# Altium project DSO.PrjPCB
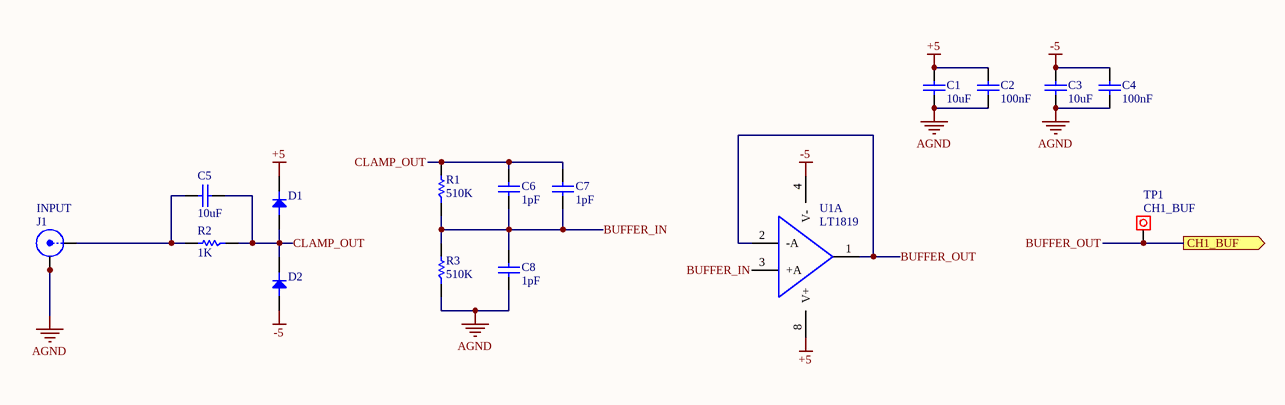
[diagram p0: DSO_Front.SchDoc]
11 sheets, 154 parts. Net scope: hierarchical (ports join the sheet entries above them; power ports are global).
Board file: DSO.PcbDoc
Sheets:
  DSO_Front.SchDoc
  DSO_Top.SchDoc
  DSO_ADC.SchDoc
  DSO_Trig.SchDoc
  DSO_Counters.SchDoc
    U_DSO_CPLD = DSO_CPLD.SchDoc
  DSO_RAM.SchDoc
  DSO_Clock.SchDoc
  DSO_Control.SchDoc
  DSO_IO.SchDoc
  DSO_Power.SchDoc

## Sheet DSO_Front.SchDoc: Schematic_Name
size A4; CompanyName: University of Melbourne; Engineer: Your Name Here; DocumentNumber: 1; Revision: 0.1; SheetNumber: 1; SheetTotal: 1; Title_Project: Project_Title; StudentNo: Student No.

### Parts
C1  10uF  [0805C]
C2  100nF  [0805C]
C3  10uF  [0805C]
C4  100nF  [0805C]
C5  10uF  [0805C]
C6  1pF  [0805C]
C7  1pF  [0805C]
C8  1pF  [0805C]
D1  Diode  [SOD-123]  (value not drawn)
D2  Diode  [SOD-123]  (value not drawn)
J1  INPUT  [BNC_VERT]
R1  510K  [0805]
R2  1K  [0805]
R3  510K  [0805]
TP1  CH1_BUF  [Testpoin]  (no BOM)
U1  LT1819  [SOIC-8]  (part A of 2)

### Ports
CH1_BUF (out)

### Nets
+5: C1.1 C2.1 D1.K U1.8(V+)
-5: C3.1 C4.1 D2.A U1.4(V-)
AGND: C1.2 C2.2 C3.2 C4.2 C8.2 J1.2(Y) J1.3(Y) J1.4(Y) J1.5(Y) R3.1
BUFFER_IN: C6.2 C7.2 C8.1 R1.1 R3.2 U1.3(+A)
BUFFER_OUT: TP1.1 U1.1(OUTA) U1.2(-A) ; port CH1_BUF
CLAMP_OUT: C5.1 C6.1 C7.1 D1.A D2.K R1.2 R2.1
NetC5_2: C5.2 J1.1(X) R2.2

### Library data of the parts
C1-C8 = C: Capacitor; Reviewed by: RM - 2018/08/05; Revision: July-2002: Re-released for DXP Platform.; Supplier 1: *; Supplier Part Number 1: *
  C1 C3 C5: Value: 10uF
  C2 C4: Value: 100nF
  C6-C8: Value: 1pF
D1 D2 = D: Reviewed by: RM - 2018/08/05; Revision: July-2002: Re-released for DXP Platform.; Supplier 1: *; Supplier Part Number 1: *
J1 = BNC: BNC Straight; Reviewed by: RM - 2018/08/05; Supplier Part Number 1: A97581-ND; Supplier 1: Digi-Key
R1-R3 = R: Resistor; Reviewed by: RM - 2018/08/05; Supplier 1: *; Suppler Part Number 1: *
  R1 R3: Value: 510K
  R2: Value: 1K
TP1 = Test Point: Pad; Value: CH1_BUF
U1 = LT1819: OpAmp High Frequency Dual; Reviewed by: RM - 2018/08/05; Supplier 1: Digi-Key; Supplier Part Number 1: LT1819CMS8#PBF-ND

## Sheet DSO_Top.SchDoc: Schematic_Name
size A4; CompanyName: University of Melbourne; Engineer: Your Name Here; DocumentNumber: 1; Revision: 0.1; SheetNumber: 1; SheetTotal: 1; Title_Project: Project_Title; StudentNo: Student No.

## Sheet DSO_ADC.SchDoc: Schematic_Name
size A4; CompanyName: University of Melbourne; Engineer: Your Name Here; DocumentNumber: 1; Revision: 0.1; SheetNumber: 1; SheetTotal: 1; Title_Project: Project_Title; StudentNo: Student No.
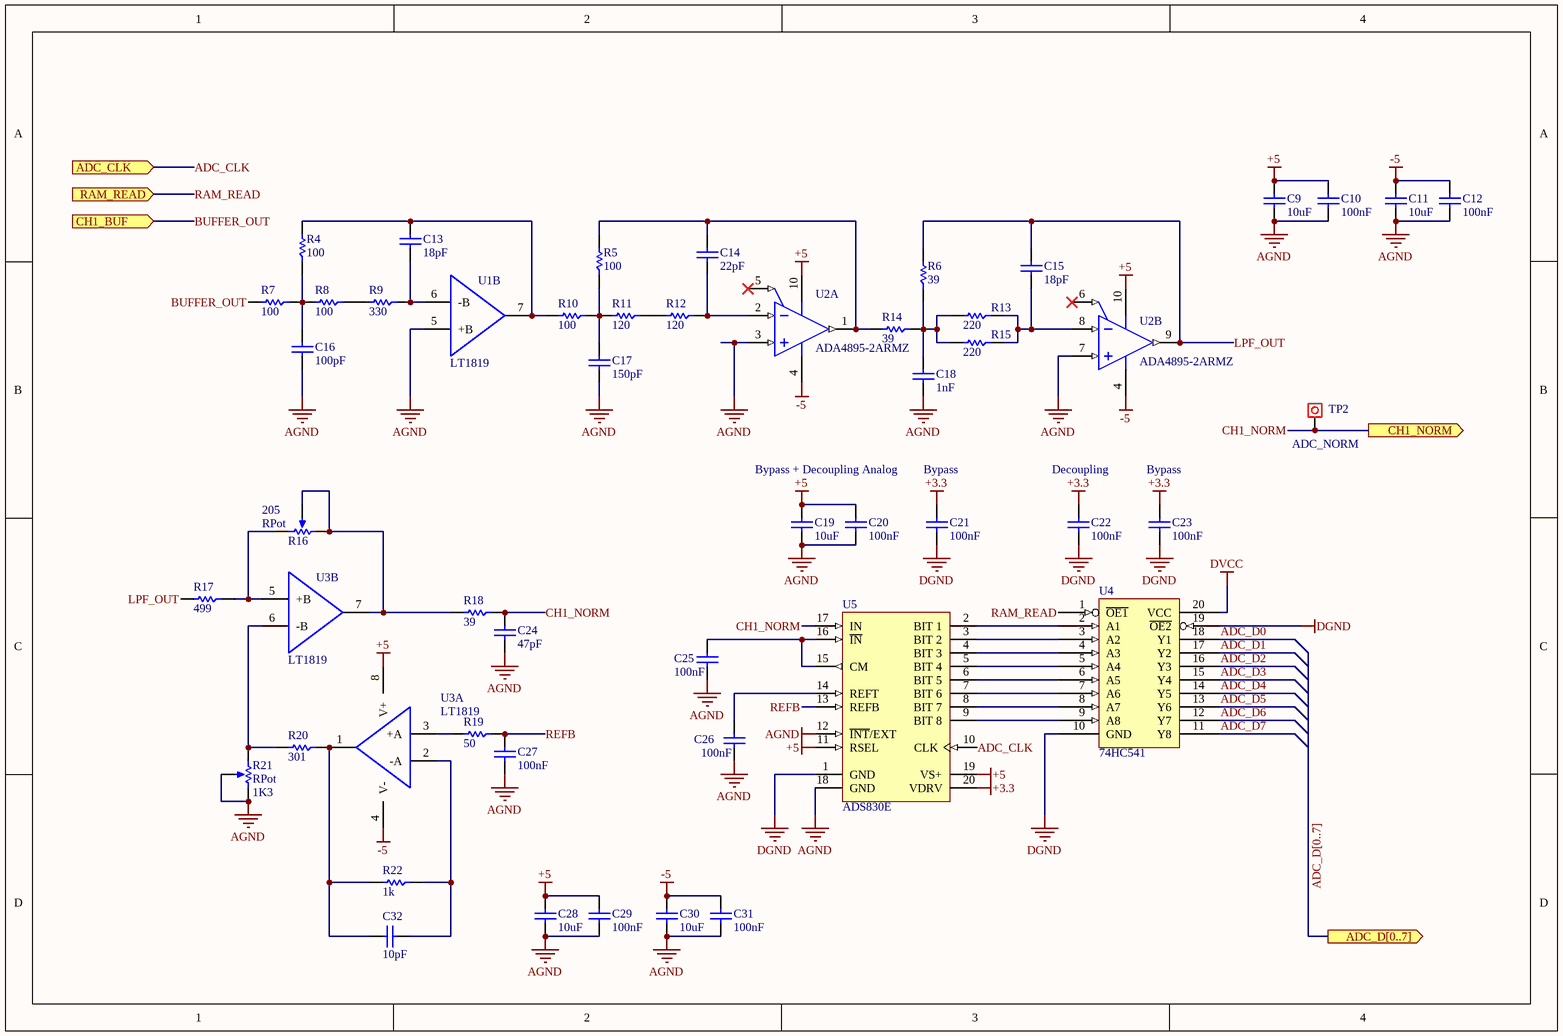
[diagram p1: DSO_ADC.SchDoc]

### Parts
C9  10uF  [0805C]
C10  100nF  [0805C]
C11  10uF  [0805C]
C12  100nF  [0805C]
C13  18pF  [0805C]
C14  22pF  [0805C]
C15  18pF  [0805C]
C16  100pF  [0805C]
C17  150pF  [0805C]
C18  1nF  [0805C]
C19  10uF  [0805C]
C20  100nF  [0805C]
C21  100nF  [0805C]
C22  100nF  [0805C]
C23  100nF  [0805C]
C24  47pF  [0805C]
C25  100nF  [0805C]
C26  100nF  [0805C]
C27  100nF  [0805C]
C28  10uF  [0805C]
C29  100nF  [0805C]
C30  10uF  [0805C]
C31  100nF  [0805C]
C32  10pF  [0805C]
R4  100  [0805]
R5  100  [0805]
R6  39  [0805]
R7  100  [0805]
R8  100  [0805]
R9  330  [0805]
R10  100  [0805]
R11  120  [0805]
R12  120  [0805]
R13  220  [0805]
R14  39  [0805]
R15  220  [0805]
R16  RPot  value 205  [VR5]
R17  499  [0805]
R18  39  [0805]
R19  50  [0805]
R20  301  [0805]
R21  RPot  value 1K3  [VR5]
R22  1k  [0805]
TP2  ADC_NORM  [Testpoin]  (no BOM)
U1  LT1819  [SOIC-8]  (part B of 2)
U2  ADA4895-2ARMZ  [ADI-RM-10_M]  (parts A,B of 2)
U3  LT1819  [SOIC-8]  (parts A,B of 2)
U4  74HC541  [SOT163-1_N]
U5  ADS830E  [TI-DBQ20_L]

### Ports
ADC_CLK (in), ADC_D[0..7] (out), CH1_BUF (in), CH1_NORM (out), RAM_READ (in)

### Nets
+3.3: C21.1 C22.1 C23.1 U4.20(VCC) U5.20(VDRV)  [also labelled DVCC]
+5: C9.1 C10.1 C19.1 C20.1 C28.1 C29.1 U2.10(+VS) U3.8(V+) U5.11(RSEL) U5.19(VS+)
-5: C11.1 C12.1 C30.1 C31.1 U2.4(-VS) U3.4(V-)
AGND: C9.2 C10.2 C11.2 C12.2 C16.2 C17.2 C18.2 C19.2 C20.2 C24.2 C25.2 C26.2 C27.2 C28.2 C29.2 C30.2 C31.2 R21.2(TAP) R21.3(BOT) U1.5(+B) U2.3(+IN_1) U2.7(+IN_2) U5.12(~{INT}/EXT) U5.18(GND)
DGND: C21.2 C22.2 C23.2 U4.10(GND) U4.19(~{OE2}) U5.1(GND)
ADC_CLK: U5.10(CLK) ; port ADC_CLK
ADC_D0: U4.18(Y1)
ADC_D1: U4.17(Y2)
ADC_D2: U4.16(Y3)
ADC_D3: U4.15(Y4)
ADC_D4: U4.14(Y5)
ADC_D5: U4.13(Y6)
ADC_D6: U4.12(Y7)
ADC_D7: U4.11(Y8)
BUFFER_OUT: R7.2 ; port CH1_BUF
CH1_NORM: C24.1 R18.1 TP2.1 U5.17(IN) ; port CH1_NORM
LPF_OUT: C15.1 R6.2 R17.2 U2.9(OUT_2)
RAM_READ: U4.1(~{OE1}) ; port RAM_READ
REFB: C27.1 R19.1 U5.13(REFB)
NetC13_1: C13.1 R4.2 R10.2 U1.7(OUTB)
NetC13_2: C13.2 R9.1 U1.6(-B)
NetC14_1: C14.1 R5.2 R14.2 U2.1(OUT_1)
NetC14_2: C14.2 R12.1 U2.2(-IN_1)
NetC15_2: C15.2 R13.1 R15.1 U2.8(-IN_2)
NetC16_1: C16.1 R4.1 R7.1 R8.2
NetC17_1: C17.1 R5.1 R10.1 R11.2
NetC18_1: C18.1 R6.1 R13.2 R14.1 R15.2
NetC25_1: C25.1 U5.15(CM) U5.16(~{IN})
NetC26_1: C26.1 U5.14(REFT)
NetC32_1: C32.1 R20.1 R22.2 U3.1(OUTA)
NetC32_2: C32.2 R22.1 U3.2(-A)
NetR8_1: R8.1 R9.2
NetR11_1: R11.1 R12.2
NetR16_1: R16.1(TOP) R16.2(TAP) R18.2 U3.7(OUTB)
NetR16_3: R16.3(BOT) R17.1 U3.5(+B)
NetR19_2: R19.2 U3.3(+A)
NetR20_2: R20.2 R21.1(TOP) U3.6(-B)
NetU4_2: U4.2(A1) U5.2(BIT_1)
NetU4_3: U4.3(A2) U5.3(BIT_2)
NetU4_4: U4.4(A3) U5.4(BIT_3)
NetU4_5: U4.5(A4) U5.5(BIT_4)
NetU4_6: U4.6(A5) U5.6(BIT_5)
NetU4_7: U4.7(A6) U5.7(BIT_6)
NetU4_8: U4.8(A7) U5.8(BIT_7)
NetU4_9: U4.9(A8) U5.9(BIT_8)

Not connected (* = marked no-connect by the designer): U2 5(~{DISABLE1})* 6(~{DISABLE2})*

### Buses and harness runs
bus ADC_D[0..7] = port ADC_D[0..7]

### Notes on the sheet
- Bypass + Decoupling Analog
- (near C21) Bypass
- Decoupling
- (near C23) Bypass

### Library data of the parts
C9-C32 = C: Capacitor; Reviewed by: RM - 2018/08/05; Revision: July-2002: Re-released for DXP Platform.; Supplier 1: *; Supplier Part Number 1: *
  C9 C11 C19 C28 C30: Value: 10uF
  C10 C12 C20-C23 C25-C27 C29 C31: Value: 100nF
  C13 C15: Value: 18pF
  C14: Value: 22pF
  C16: Value: 100pF
  C17: Value: 150pF
  C18: Value: 1nF
  C24: Value: 47pF
  C32: Value: 10pF
R4-R15 R17-R20 R22 = R: Resistor; Reviewed by: RM - 2018/08/05; Supplier 1: *; Suppler Part Number 1: *
  R4 R5 R7 R8 R10: Value: 100
  R6 R14 R18: Value: 39
  R9: Value: 330
  R11 R12: Value: 120
  R13 R15: Value: 220
  R17: Value: 499
  R19: Value: 50
  R20: Value: 301
  R22: Value: 1k
R16 R21 = RPot: Potentiometer; Sim Note: Enter the Resistance value and the set point into parameter fields.; Set Position: 0.5; Published: 8-Jun-2000; LatestRevisionDate: 17-Jul-2002; LatestRevisionNote: Re-released for DXP Platform.; PackageReference: VR5; Publisher: Altium Limited; PackageDescription: Variable Resistor, Thru-Hole; 3 Leads
TP2 = Test Point: Pad; Value: ADC_NORM
U1 U3 = LT1819: as U1 on sheet DSO_Front; Supplier 1: Digi-Key; Supplier Part Number 1: LT1819CMS8#PBF-ND
U2 = CMP-0384-01589-1: Double Channel Low Wide Band Noise Operational Amplifier, 236 MHz BW, 943 V/us SR, Industrial, 10-pin SOP (RM-10), Tray; Manufacturer: Analog Devices; Amplifiers Per Package: 2; Small Signal Bandwidth: 236MHz; V Span Min: 3V; Input Offset Voltage: 28uV; Iq/Amp: 3mA; Input Bias Current: 11uA; V Span Max: 10V; ComponentLink1Description: Manufacturer URL; ComponentLink3Description: Package Specification; ComponentLink3URL: http://www.analog.com/static/imported-files/packages/PKG_PDF/MSOP%28RM%29/RM_10.pdf; Code_JEDEC: MO-187-BA; Slew Rate: 943V/us; ComponentLink2Description: Datasheet; Generic Part Number: ADA4895-2; PackageReference: RM-10; ComponentLink2URL: http://www.analog.com/static/imported-files/data_sheets/ADA4895-2.PDF; Mounting Technology: Surface Mount; DatasheetVersion: Rev. 0; PartNumber: ADA4895-2ARMZ; ComponentLink1URL: http://www.analog.com/en/index.html; Packing: Tray; PackageDescription: 10-Pin Mini Small Outline Package, Body 3 x 3 mm, Pitch 0.5 mm
U4 = 74HC541: (ADV) Octal Buffer, Line Driver; Reviewed by: RM - 2018/08/05; Supplier 1: Digi-Key; Supplier Part Number 1: 296-1202-1-ND
U5 = ADS830E: 8-Bit, 60 MSPS ADC Single-Ended / Differential Input, Internal / External Reference and Programmble Input Range, -40 to 85 degC, 20-pin SOP (DBQ20), Green (RoHS & no Sb/Br); Reviewed by: RM - 2018/08/05; ComponentLink2URL: http://www.ti.com/general/docs/lit/getliterature.tsp?genericPartNumber=ADS830&fileType=pdf; ComponentLink2Description: Datasheet; ComponentLink1URL: http://www.ti.com/; ComponentLink3URL: http://www.ti.com/litv/pdf/mpds210a; ComponentLink3Description: Package Specification; ComponentLink1Description: Manufacturer URL; Supplier 1: Digi-Key; Supplier Part Number 1: ADS830E-ND

## Sheet DSO_Trig.SchDoc: Schematic_Name
size A4; CompanyName: University of Melbourne; Engineer: Your Name Here; DocumentNumber: 1; Revision: 0.1; SheetNumber: 1; SheetTotal: 1; Title_Project: Project_Title; StudentNo: Student No.
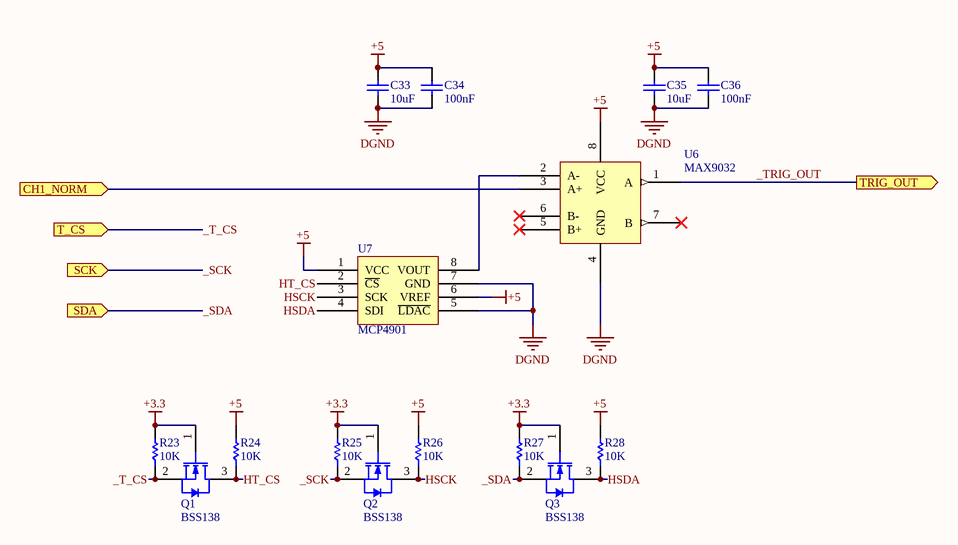
[diagram p2: DSO_Trig.SchDoc]

### Parts
C33  10uF  [0805C]
C34  100nF  [0805C]
C35  10uF  [0805C]
C36  100nF  [0805C]
Q1  BSS138  [SOT23]
Q2  BSS138  [SOT23]
Q3  BSS138  [SOT23]
R23  10K  [0805]
R24  10K  [0805]
R25  10K  [0805]
R26  10K  [0805]
R27  10K  [0805]
R28  10K  [0805]
U6  MAX9032  [SOIC-8]
U7  MCP4901  [SOIC-8]

### Ports
CH1_NORM (in), SCK (in), SDA (in), T_CS (in), TRIG_OUT (out)

### Nets
+3.3: Q1.1(G) Q2.1(G) Q3.1(G) R23.2 R25.2 R27.2
+5: C33.1 C34.1 C35.1 C36.1 R24.2 R26.2 R28.2 U6.8(VCC) U7.1(VCC) U7.6(VREF)
DGND: C33.2 C34.2 C35.2 C36.2 U6.4(GND) U7.5(~{LDAC}) U7.7(GND)
_SCK: Q2.2(S) R25.1 ; port SCK
_SDA: Q3.2(S) R27.1 ; port SDA
_T_CS: Q1.2(S) R23.1 ; port T_CS
_TRIG_OUT: U6.1(A) ; port TRIG_OUT
HSCK: Q2.3(D) R26.1 U7.3(SCK)
HSDA: Q3.3(D) R28.1 U7.4(SDI)
HT_CS: Q1.3(D) R24.1 U7.2(~{CS})
NetU6_2: U6.2(A-) U7.8(VOUT)
NetU6_3: U6.3(A+) ; port CH1_NORM

Not connected (* = marked no-connect by the designer): U6 5(B+)* 6(B-)* 7(B)*

### Library data of the parts
C33-C36 = C: Capacitor; Reviewed by: RM - 2018/08/05; Revision: July-2002: Re-released for DXP Platform.; Supplier 1: *; Supplier Part Number 1: *
  C33 C35: Value: 10uF
  C34 C36: Value: 100nF
Q1-Q3 = MOSFET-N: N-Channel MOSFET; PackageDocument: 1995/1996; Published: 8-Jun-2000; LatestRevisionDate: 17-Jul-2002; LatestRevisionNote: Re-released for DXP Platform.; PackageReference: E3; Publisher: Altium Limited
R23-R28 = R: Resistor; Reviewed by: RM - 2018/08/05; Supplier 1: *; Suppler Part Number 1: *; Value: 10K
U6 = MAX9032: Dual Comparator; Reviewed by: RM - 2018/08/05; Supplier 1: Digi-Key; Supplier Part Number 1: MAX9032ASA-ND
U7 = MCP4901: DAC 8bit SPI; Reviewed by: RM - 2018/08/05; Supplier 1: Digi-Key; Supplier Part Number 1: MCP4901-E/SN-ND

## Sheet DSO_Counters.SchDoc: Schematic_Name
size A4; CompanyName: University of Melbourne; DrawnBy: Student_#; Engineer: Your Name Here; Organization: University of Melbourne; DocumentNumber: 5; Revision: 0.1; SheetNumber: 5; SheetTotal: 10; Title_Project: Project_Title
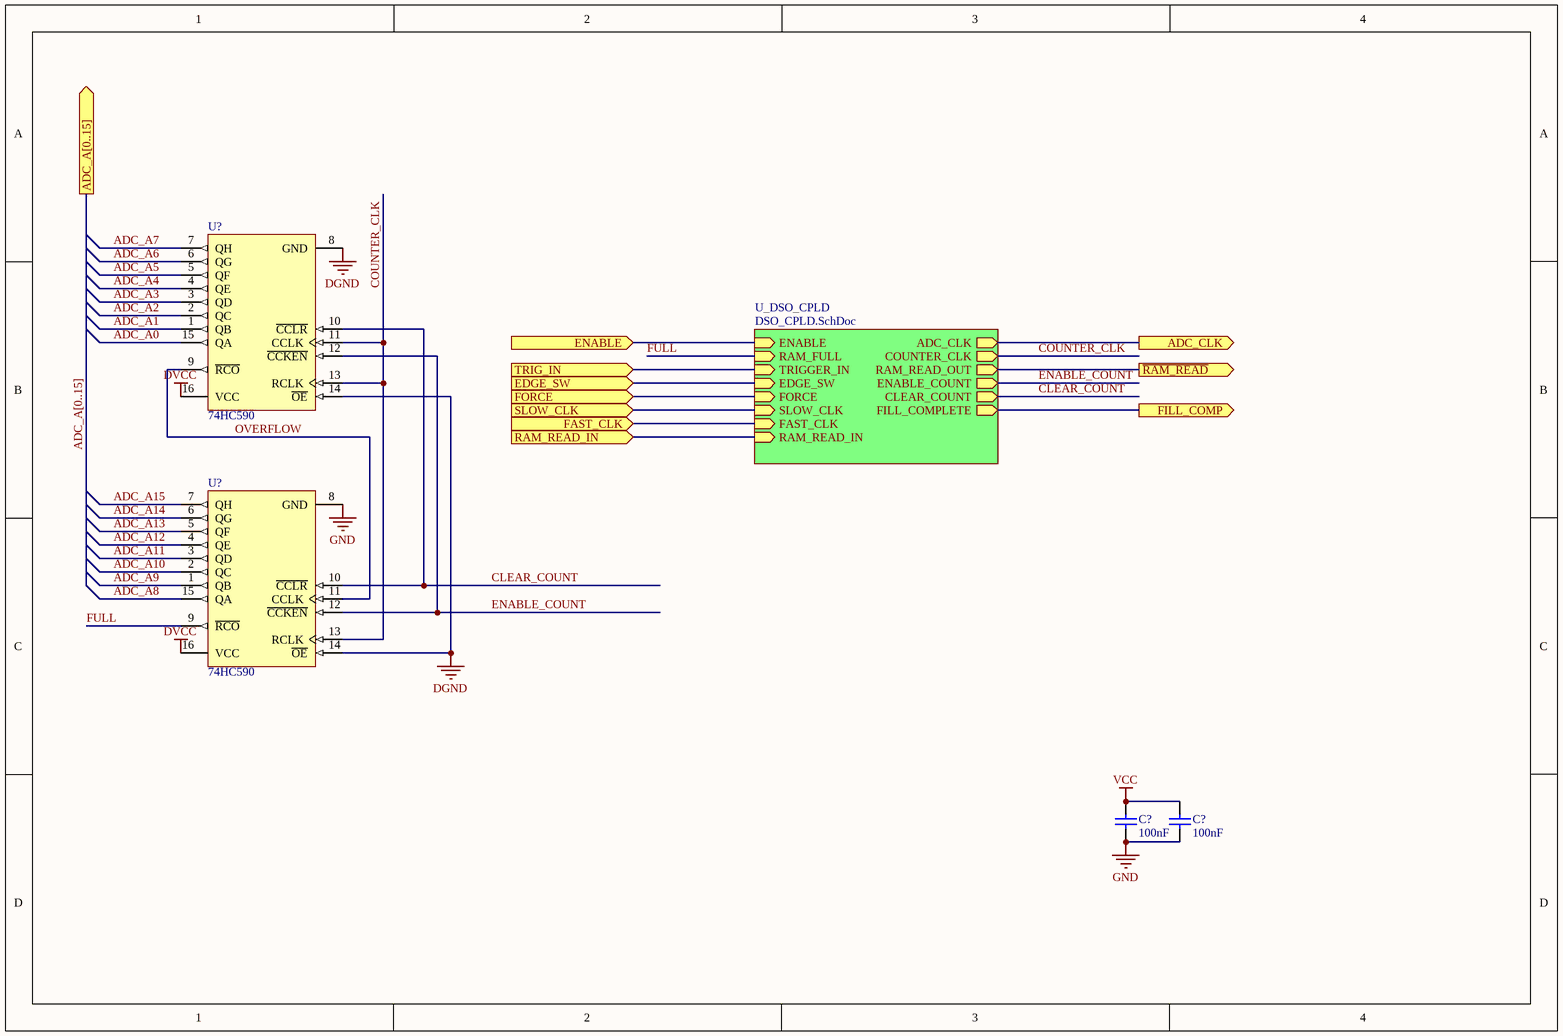
[diagram p3: DSO_Counters.SchDoc]

### Parts
(Parts that share a designator on the sheet are numbered #1, #2 ... from top to bottom, then left to right.)
C?#1  100nF  [0805C]
C?#2  100nF  [0805C]
U?#1  74HC590  [SOIC-16]
U?#2  74HC590  [SOIC-16]

### Sub-sheets
U_DSO_CPLD = DSO_CPLD.SchDoc: ENABLE (in), RAM_FULL (in), TRIGGER_IN (in), EDGE_SW (in), FORCE (in), SLOW_CLK (in), FAST_CLK (in), RAM_READ_IN (in), ADC_CLK (out), COUNTER_CLK (out), RAM_READ_OUT (out), ENABLE_COUNT (out), CLEAR_COUNT (out), FILL_COMPLETE (out)

### Ports
ADC_A[0..15] (out), ADC_CLK (out), EDGE_SW (in), ENABLE (in), FAST_CLK (in), FILL_COMP (out), FORCE (in), RAM_READ_IN (in), SLOW_CLK (in), TRIG_IN (in), ~{RAM_READ} (out)

### Nets
DGND: U?#1.8(GND) U?#1.14(~{OE}) U?#2.14(~{OE})
DVCC: U?#1.16(VCC) U?#2.16(VCC)  [project net +3.3]
GND: C?#1.2 C?#2.2 U?#2.8(GND)
VCC: C?#1.1 C?#2.1
ADC_A0: U?#1.15(QA)
ADC_A1: U?#1.1(QB)
ADC_A2: U?#1.2(QC)
ADC_A3: U?#1.3(QD)
ADC_A4: U?#1.4(QE)
ADC_A5: U?#1.5(QF)
ADC_A6: U?#1.6(QG)
ADC_A7: U?#1.7(QH)
ADC_A8: U?#2.15(QA)
ADC_A9: U?#2.1(QB)
ADC_A10: U?#2.2(QC)
ADC_A11: U?#2.3(QD)
ADC_A12: U?#2.4(QE)
ADC_A13: U?#2.5(QF)
ADC_A14: U?#2.6(QG)
ADC_A15: U?#2.7(QH)
CLEAR_COUNT: U?#1.10(~{CCLR}) U?#2.10(~{CCLR}) ; sheet U_DSO_CPLD/CLEAR_COUNT
COUNTER_CLK: U?#1.11(CCLK) U?#1.13(RCLK) U?#2.13(RCLK) ; sheet U_DSO_CPLD/COUNTER_CLK
ENABLE_COUNT: U?#1.12(~{CCKEN}) U?#2.12(~{CCKEN}) ; sheet U_DSO_CPLD/ENABLE_COUNT
FULL: U?#2.9(~{RCO}) ; sheet U_DSO_CPLD/RAM_FULL
OVERFLOW: U?#1.9(~{RCO}) U?#2.11(CCLK)
NetU17_1: port ENABLE, sheet U_DSO_CPLD/ENABLE
NetU17_2: port FORCE, sheet U_DSO_CPLD/FORCE
NetU17_3: port RAM_READ_IN, sheet U_DSO_CPLD/RAM_READ_IN
NetU17_5: port EDGE_SW, sheet U_DSO_CPLD/EDGE_SW
NetU17_6: port ~{RAM_READ}, sheet U_DSO_CPLD/RAM_READ_OUT
NetU17_12: port TRIG_IN, sheet U_DSO_CPLD/TRIGGER_IN
NetU17_28: port FILL_COMP, sheet U_DSO_CPLD/FILL_COMPLETE
NetU17_41: port ADC_CLK, sheet U_DSO_CPLD/ADC_CLK
NetU17_43: port SLOW_CLK, sheet U_DSO_CPLD/SLOW_CLK
NetU17_44: port FAST_CLK, sheet U_DSO_CPLD/FAST_CLK

### Buses and harness runs
bus ADC_A[0..15] = port ADC_A[0..15]

### Library data of the parts
C?#1 C?#2 = C: Capacitor; Reviewed by: RM - 2018/08/05; Revision: July-2002: Re-released for DXP Platform.; Value: 100nF; Supplier 1: *; Supplier Part Number 1: *
U?#1 U?#2 = 74HC590: 8-Bit Binary Counter Register; Reviewed by: RM - 2018/08/05; ComponentLink1Description: Manufacturer Link; ComponentLink1URL: http://www.st.com/; ComponentLink2Description: Datasheet; ComponentLink2URL: http://www.st.com/stonline/products/literature/ds/1986/m74hc590.pdf; Supplier 1: Digi-Key; Supplier Part Number 1: 296-17132-1-ND

## Sheet DSO_CPLD.SchDoc
size A4
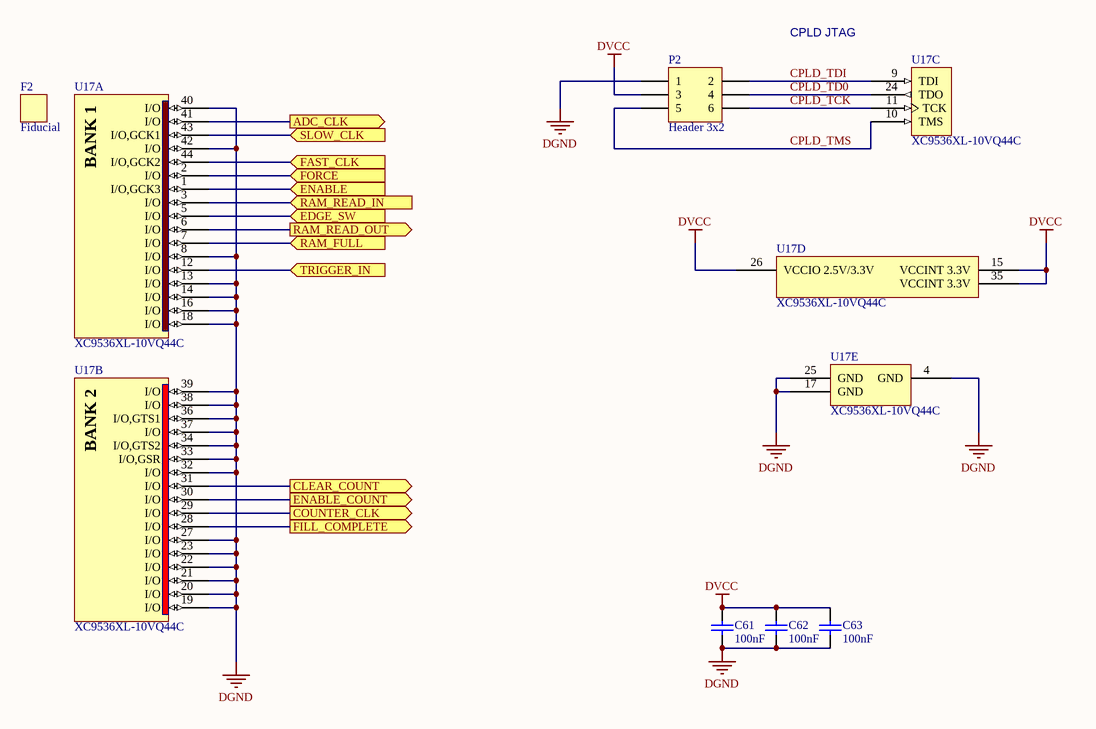
[diagram p4: DSO_CPLD.SchDoc]

### Parts
C61  100nF  [0805C]
C62  100nF  [0805C]
C63  100nF  [0805C]
F2  Fiducial  [FIDUCIAL]  (no BOM)
P2  Header 3x2  [HDR3x2]
U17  XC9536XL-10VQ44C  [VQ44_L]  (parts A,B,C,D,E of 5)

### Ports
ADC_CLK (out), CLEAR_COUNT (out), COUNTER_CLK (out), EDGE_SW (in), ENABLE (in), ENABLE_COUNT (out), FAST_CLK (in), FILL_COMPLETE (out), FORCE (in), RAM_FULL (in), RAM_READ_IN (in), RAM_READ_OUT (out), SLOW_CLK (in), TRIGGER_IN (in)

### Nets
DGND: C61.2 C62.2 C63.2 P2.1 U17.4(GND) U17.8(I/O) U17.13(I/O) U17.14(I/O) U17.16(I/O) U17.17(GND) U17.18(I/O) U17.19(I/O) U17.20(I/O) U17.21(I/O) U17.22(I/O) U17.23(I/O) U17.25(GND) U17.27(I/O) U17.32(I/O) U17.33(I/O,GSR) U17.34(I/O,GTS2) U17.36(I/O,GTS1) U17.37(I/O) U17.38(I/O) U17.39(I/O) U17.40(I/O) U17.42(I/O)
DVCC: C61.1 C62.1 C63.1 P2.3 U17.15(VCCINT_3.3V) U17.26(VCCIO_2.5V/3.3V) U17.35(VCCINT_3.3V)  [project net +3.3]
CLEAR_COUNT: U17.31(I/O) ; port CLEAR_COUNT
COUNTER_CLK: U17.29(I/O) ; port COUNTER_CLK
CPLD_TCK: P2.6 U17.11(TCK)
CPLD_TD0: P2.4 U17.24(TDO)
CPLD_TDI: P2.2 U17.9(TDI)
CPLD_TMS: P2.5 U17.10(TMS)
ENABLE_COUNT: U17.30(I/O) ; port ENABLE_COUNT
FULL: U17.7(I/O) ; port RAM_FULL
NetU17_1: U17.1(I/O,GCK3) ; port ENABLE
NetU17_2: U17.2(I/O) ; port FORCE
NetU17_3: U17.3(I/O) ; port RAM_READ_IN
NetU17_5: U17.5(I/O) ; port EDGE_SW
NetU17_6: U17.6(I/O) ; port RAM_READ_OUT
NetU17_12: U17.12(I/O) ; port TRIGGER_IN
NetU17_28: U17.28(I/O) ; port FILL_COMPLETE
NetU17_41: U17.41(I/O) ; port ADC_CLK
NetU17_43: U17.43(I/O,GCK1) ; port SLOW_CLK
NetU17_44: U17.44(I/O,GCK2) ; port FAST_CLK

### Notes on the sheet
- CPLD JTAG
- (in symbol XC9536XL-10VQG44C, part A) BANK 1
- (in symbol XC9536XL-10VQG44C, part B) BANK 2

### Library data of the parts
C61-C63 = C: Capacitor; Reviewed by: RM - 2018/08/05; Revision: July-2002: Re-released for DXP Platform.; Value: 100nF; Supplier 1: *; Supplier Part Number 1: *
F2 = Fiducial: Fiducial for pick and place machine
P2 = Header 3x2: Header, 5-Pin; Reviewed by: RM - 2018/08/05; Supplier 1: Digi-Key; Supplier Part Number 1: 952-2121-ND
U17 = XC9536XL-10VQG44C: FastFLASH XC900XL, 3.3V High-Performance 36 Macrocell CPLD, 34 User I/Os, 44-Pin VQFP, Speed Grade 10, Commercial Grade; Reviewed by: RM - 2018/08/05; Supplier 1: Digi-Key; Supplier Part Number 1: 122-1385-ND

## Sheet DSO_RAM.SchDoc: Schematic_Name
size A4; CompanyName: University of Melbourne; Engineer: Your Name Here; DocumentNumber: 1; Revision: 0.1; SheetNumber: 1; SheetTotal: 1; Title_Project: Project_Title; StudentNo: Student No.
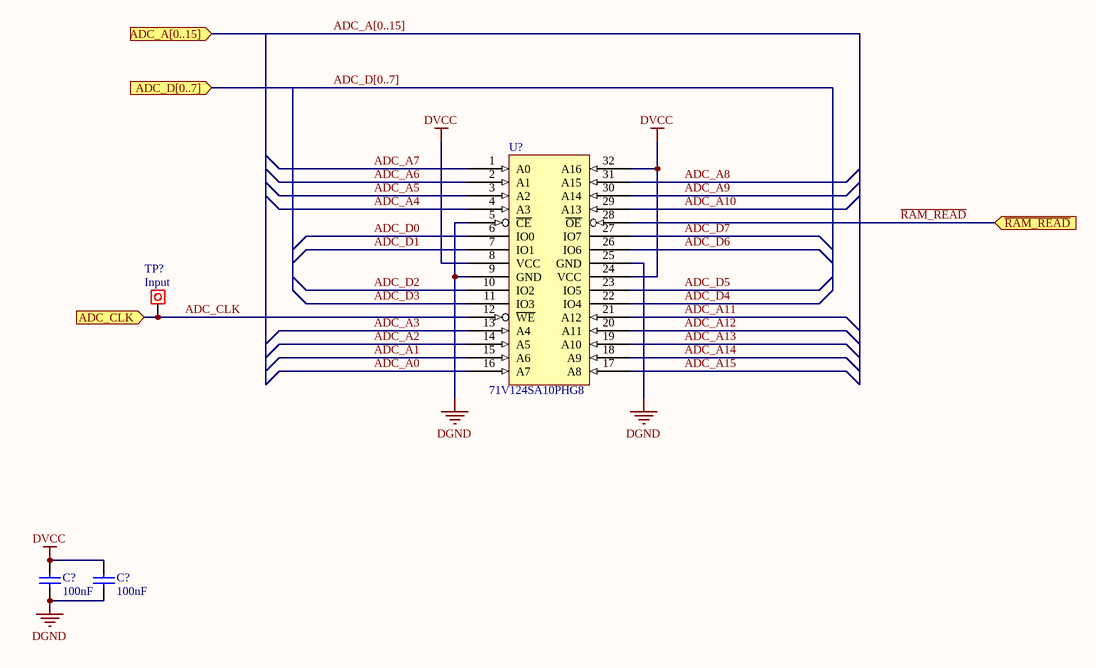
[diagram p5: DSO_RAM.SchDoc]

### Parts
(Parts that share a designator on the sheet are numbered #1, #2 ... from top to bottom, then left to right.)
C?#3  100nF  [0805C]
C?#4  100nF  [0805C]
TP?  INPUT  [Testpoin]
U?#3  71V124SA10PHG8  [TSOP-32]

### Ports
ADC_A[0..15] (in), ADC_CLK (in), ADC_D[0..7] (in), ~{RAM_READ} (in)

### Nets
DGND: C?#3.2 C?#4.2 U?#3.5(~{CE}) U?#3.9(GND) U?#3.25(GND)
DVCC: C?#3.1 C?#4.1 U?#3.8(VCC) U?#3.24(VCC) U?#3.32(A16)  [project net +3.3]
ADC_A0: U?#3.16(A7)
ADC_A1: U?#3.15(A6)
ADC_A2: U?#3.14(A5)
ADC_A3: U?#3.13(A4)
ADC_A4: U?#3.4(A3)
ADC_A5: U?#3.3(A2)
ADC_A6: U?#3.2(A1)
ADC_A7: U?#3.1(A0)
ADC_A8: U?#3.31(A15)
ADC_A9: U?#3.30(A14)
ADC_A10: U?#3.29(A13)
ADC_A11: U?#3.21(A12)
ADC_A12: U?#3.20(A11)
ADC_A13: U?#3.19(A10)
ADC_A14: U?#3.18(A9)
ADC_A15: U?#3.17(A8)
ADC_CLK: TP?.1 U?#3.12(~{WE}) ; port ADC_CLK
ADC_D0: U?#3.6(IO0)
ADC_D1: U?#3.7(IO1)
ADC_D2: U?#3.10(IO2)
ADC_D3: U?#3.11(IO3)
ADC_D4: U?#3.22(IO4)
ADC_D5: U?#3.23(IO5)
ADC_D6: U?#3.26(IO6)
ADC_D7: U?#3.27(IO7)
~{RAM_READ}: U?#3.28(~{OE}) ; port ~{RAM_READ}

### Buses and harness runs
bus ADC_A[0..15] = port ADC_A[0..15]
bus ADC_D[0..7] = port ADC_D[0..7]

### Library data of the parts
C?#3 C?#4 = C: Capacitor; Reviewed by: RM - 2018/08/05; Revision: July-2002: Re-released for DXP Platform.; Value: 100nF; Supplier 1: *; Supplier Part Number 1: *
TP? = Test Point: Pad; Value: Input
U?#3 = CY7C1019D: SRAM 128k x 8; Reviewed by: RM - 2018/08/05; Supplier 1: Digi-Key; Supplier Part Number 1: 428-1967-ND

## Sheet DSO_Clock.SchDoc: Schematic_Name
size A4; CompanyName: University of Melbourne; Engineer: Your Name Here; DocumentNumber: 1; Revision: 0.1; SheetNumber: 1; SheetTotal: 1; Title_Project: Project_Title; StudentNo: Student No.
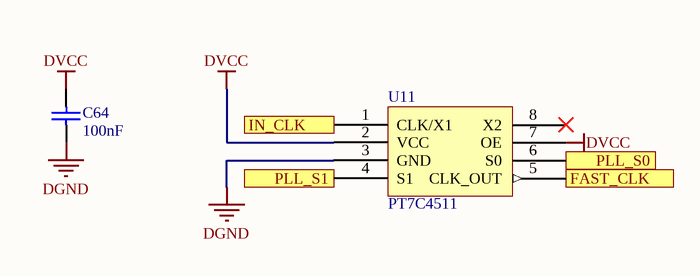
[diagram p6: DSO_Clock.SchDoc]

### Parts
C64  100nF  [0805C]
U11  PT7C4511  [SOIC-8]

### Ports
FAST_CLK (out), IN_CLK (in), PLL_S0 (in), PLL_S1 (in)

### Nets
DGND: C64.2 U11.3(GND)
DVCC: C64.1 U11.2(VCC) U11.7(OE)  [project net +3.3]
NetU11_1: U11.1(CLK/X1) ; port IN_CLK
NetU11_4: U11.4(S1) ; port PLL_S1
NetU11_5: U11.5(CLK_OUT) ; port FAST_CLK
NetU11_6: U11.6(S0) ; port PLL_S0

Not connected (* = marked no-connect by the designer): U11 8(X2)*

### Library data of the parts
C64 = C: Capacitor; Reviewed by: RM - 2018/08/05; Revision: July-2002: Re-released for DXP Platform.; Value: 100nF; Supplier 1: *; Supplier Part Number 1: *
U11 = PT7C4511: PLL Clock Multiplier; Reviewed by: RM - 2018/08/05; Supplier 1: Digi-Key; Supplier Part Number 1: PT7C4511WEXDICT-ND

## Sheet DSO_Control.SchDoc: Schematic_Name
size A4; CompanyName: University of Melbourne; Engineer: Your Name Here; DocumentNumber: 1; Revision: 0.1; SheetNumber: 1; SheetTotal: 1; Title_Project: Project_Title; StudentNo: Student No.
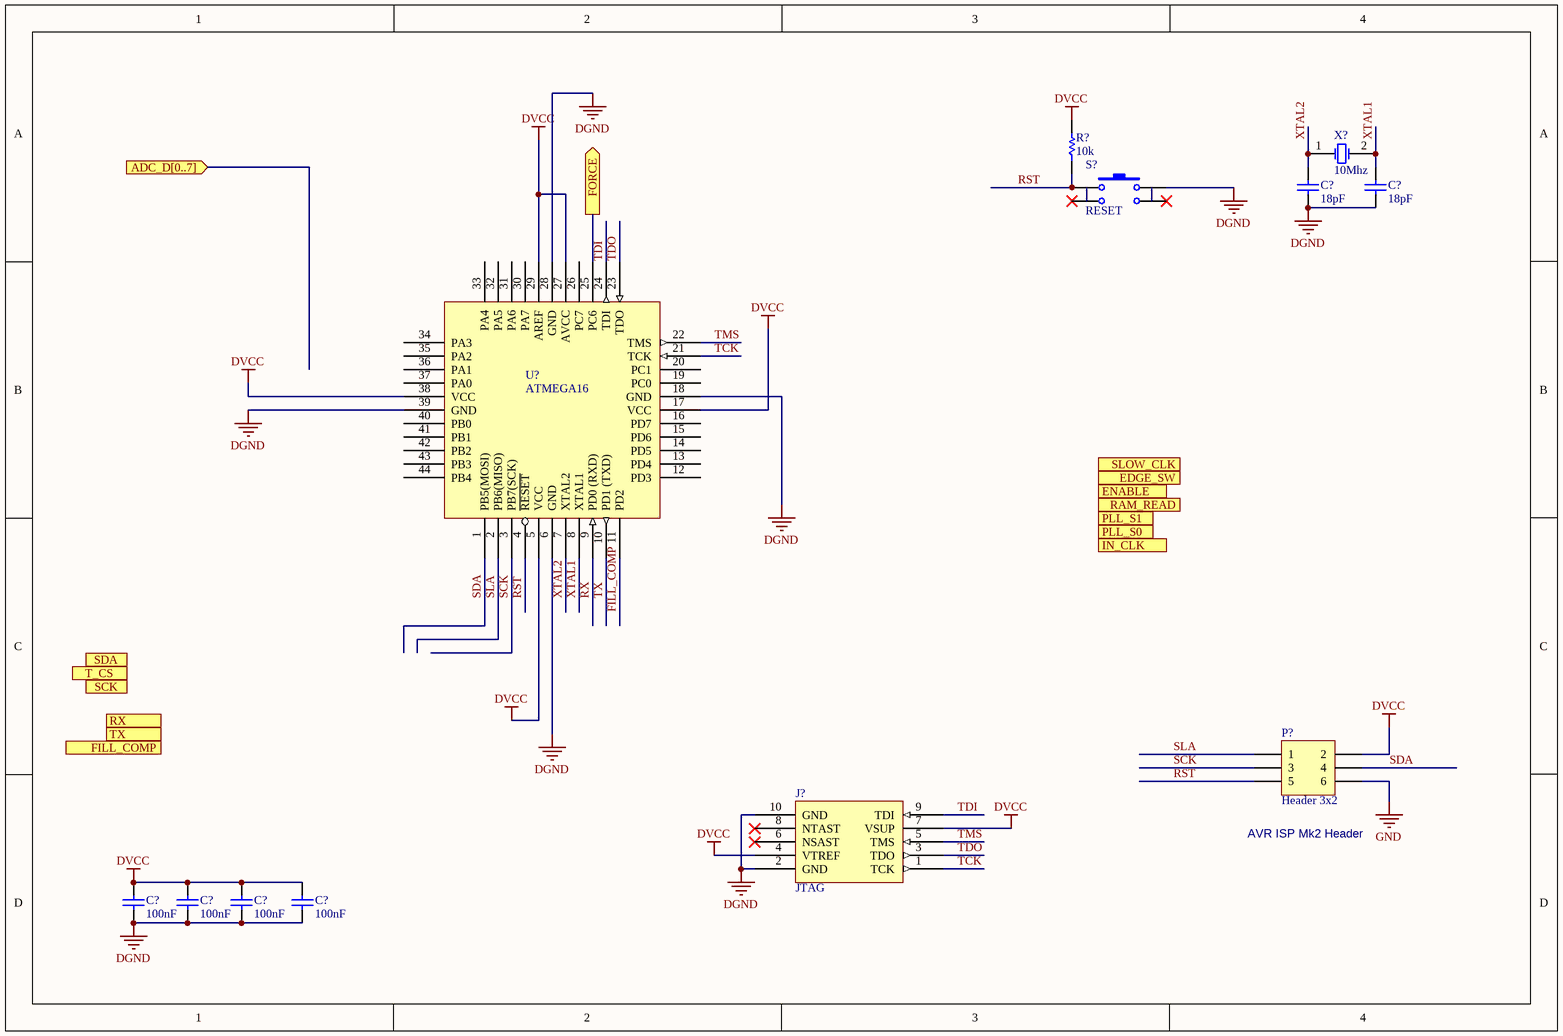
[diagram p7: DSO_Control.SchDoc]

### Parts
(Parts that share a designator on the sheet are numbered #1, #2 ... from top to bottom, then left to right.)
C?#5  18pF  [0805C]
C?#6  18pF  [0805C]
C?#7  100nF  [0805C]
C?#8  100nF  [0805C]
C?#9  100nF  [0805C]
C?#10  100nF  [0805C]
J?  JTAG  [BOXEDVERT10]
P?  Header 3x2  [HDR3x2]
R?  10k  [0805]
S?  RESET  [SPST PB SWITCH SMD]
U?#4  ATMEGA16  [QFP-48]
X?  10Mhz  [XTAL_FLAT_SMD]

### Ports
ADC_D[0..7] (in), EDGE_SW (out), ENABLE (out), FILL_COMP (in), FORCE (out), IN_CLK (out), PLL_S0 (out), PLL_S1 (out), RAM_READ (out), RX (in), SCK (out), SDA (out), SLOW_CLK (out), T_CS (out), TX (out)

### Nets
DGND: C?#5.2 C?#6.2 C?#7.2 C?#8.2 C?#9.2 C?#10.2 J?.2(GND) J?.10(GND) S?.2 U?#4.6(GND) U?#4.18(GND) U?#4.28(GND) U?#4.39(GND)
DVCC: C?#7.1 C?#8.1 C?#9.1 C?#10.1 J?.4(VTREF) J?.7(VSUP) P?.2 R?.2 U?#4.5(VCC) U?#4.17(VCC) U?#4.27(AVCC) U?#4.29(AREF) U?#4.38(VCC)  [project net +3.3]
GND: P?.6
FILL_COMP: U?#4.11(PD2)
RST: P?.5 R?.1 S?.1 U?#4.4(~{RESET})
RX: U?#4.9(PD0_(RXD))
SCK: P?.3 U?#4.3(PB7(SCK))
SDA: P?.4 U?#4.1(PB5(MOSI))
SLA: P?.1 U?#4.2(PB6(MISO))
TCK: J?.1(TCK) U?#4.21(TCK)
TDI: J?.9(TDI) U?#4.24(TDI)
TDO: J?.3(TDO) U?#4.23(TDO)
TMS: J?.5(TMS) U?#4.22(TMS)
TX: U?#4.10(PD1_(TXD))
XTAL1: C?#6.1 U?#4.8(XTAL1) X?.2(OSC2)
XTAL2: C?#5.1 U?#4.7(XTAL2) X?.1(OSC1)
NetU?#4_25: U?#4.25(PC6) ; port FORCE

Not connected (* = marked no-connect by the designer): J? 6(NSAST)* 8(NTAST)*; S? 3* 4*; U?#4 12(PD3) 13(PD4) 14(PD5) 15(PD6) 16(PD7) 19(PC0) 20(PC1) 26(PC7) 30(PA7) 31(PA6) 32(PA5) 33(PA4) 34(PA3) 35(PA2) 36(PA1) 37(PA0) 40(PB0) 41(PB1) 42(PB2) 43(PB3) 44(PB4)

### Notes on the sheet
- (near P?) AVR ISP Mk2 Header

### Library data of the parts
C?#5-C?#10 = C: Capacitor; Reviewed by: RM - 2018/08/05; Revision: July-2002: Re-released for DXP Platform.; Supplier 1: *; Supplier Part Number 1: *
  C?#5 C?#6: Value: 18pF
  C?#7-C?#10: Value: 100nF
J? = JTAG_CON: Reviewed by: RM - 2018/08/05; Supplier 1: Digi-Key; Supplier Part Number 1: OR896-ND
P? = Header 3x2: as P2 on sheet DSO_CPLD; Supplier 1: Digi-Key; Supplier Part Number 1: 952-2121-ND
R? = R: Resistor; Reviewed by: RM - 2018/08/05; Value: 10k; Supplier 1: *; Suppler Part Number 1: *
S? = SW_PB_1P1T4: Momentary Push Button Switch 1P 1T 2pins; Reviewed by: RM - 2018/08/05; Revision: July-2002: Re-released for DXP Platform.; Supplier 1: Digi-Key; Supplier Part Number 1: CKN9085CT-ND
U?#4 = ATMEGA16: ATMEGA16 Microcontroller; Reviewed by: RM - 2018/08/05; Supplier 1: Digi-Key; Supplier Part Number 1: ATMEGA16A-AU-ND
X? = XTAL: Crystal Oscillator; Reviewed by: RM - 2018/08/05; Revision: July-2002: Re-released for DXP Platform.; Supplier 1: Digi-Key; Supplier Part Number 1: 887-1080-1-ND

## Sheet DSO_IO.SchDoc: Schematic_Name
size A4; CompanyName: University of Melbourne; Engineer: Your Name Here; DocumentNumber: 1; Revision: 0.1; SheetNumber: 1; SheetTotal: 1; Title_Project: Project_Title; StudentNo: Student No.
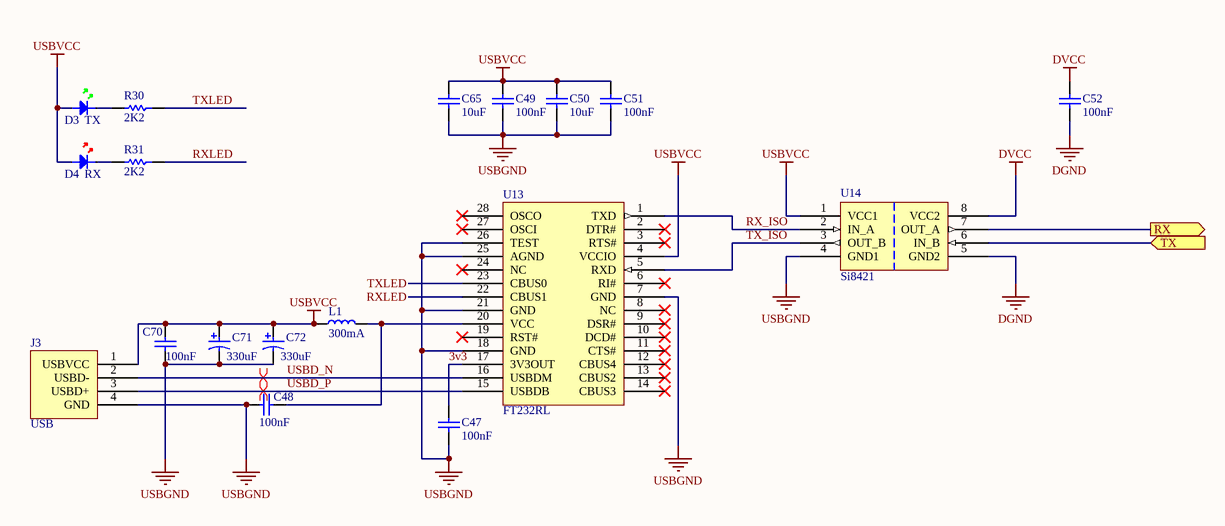
[diagram p8: DSO_IO.SchDoc]

### Parts
C47  100nF  [0805C]
C48  100nF  [0805C]
C49  100nF  [0805C]
C50  10uF  [0805C]
C51  100nF  [0805C]
C52  100nF  [0805C]
C65  10uF  [0805C]
C70  100nF  [0805C]
C71  Capacitance: 330uF  [CAPMP7344X31-T_V]  (hidden comment: TPSD337K006R0050)
C72  Capacitance: 330uF  [CAPMP7344X31-T_V]  (hidden comment: TPSD337K006R0050)
D3  TX  [0805D-GREEN]
D4  RX  [0805D-RED]
J3  USB  [USBPLUG]
L1  300mA  [0805]
R30  2K2  [0805]
R31  2K2  [0805]
U13  FT232RL  [SSOP-28]
U14  Si8421  [SOIC-8]

### Ports
RX (out), TX (in)

### Nets
DGND: C52.2 U14.5(GND2)
DVCC: C52.1 U14.8(VCC2)  [project net +3.3]
USBGND: C47.2 C48.1 C49.2 C50.2 C51.2 C65.2 C70.2 C71.2 C72.2 J3.4(GND) U13.7(GND) U13.18(GND) U13.21(GND) U13.25(AGND) U13.26(TEST) U14.4(GND1)
USBVCC: C49.1 C50.1 C51.1 C65.1 C70.1 C71.1 C72.1 D3.A D4.A J3.1(USBVCC) L1.1 U13.4(VCCIO) U14.1(VCC1)
3v3: C47.1 U13.17(3V3OUT)
RX_ISO: U13.1(TXD) U14.2(IN_A)
RXLED: R31.1 U13.22(CBUS1)
TX_ISO: U13.5(RXD) U14.3(OUT_B)
TXLED: R30.1 U13.23(CBUS0)
USBD_N: J3.2(USBD-) U13.16(USBDM)
USBD_P: J3.3(USBD+) U13.15(USBDB)
NetC48_2: C48.2 L1.2 U13.20(VCC)
NetD3_K: D3.K R30.2
NetD4_K: D4.K R31.2
NetU14_6: U14.6(IN_B) ; port TX
NetU14_7: U14.7(OUT_A) ; port RX

Not connected (* = marked no-connect by the designer): U13 2(DTR#)* 3(RTS#)* 6(RI#)* 8(NC)* 9(DSR#)* 10(DCD#)* 11(CTS#)* 12(CBUS4)* 13(CBUS2)* 14(CBUS3)* 19(RST#)* 24(NC)* 27(OSCI)* 28(OSCO)*

### Layout directives
differential pair: USBD_N, USBD_P

### Library data of the parts
C47-C52 C65 C70 = C: Capacitor; Reviewed by: RM - 2018/08/05; Revision: July-2002: Re-released for DXP Platform.; Supplier 1: *; Supplier Part Number 1: *
  C47-C49 C51 C52 C70: Value: 100nF
  C50 C65: Value: 10uF
C71 C72 = CMP-2000-07305-1: Low ESR, 330 uF, 6.3 V, +/- 10%, -55 to 125 degC, 2-Pin SMD, RoHS, Tape and Reel; Manufacturer: AVX; Rad Hardened: No; DF: 8%; Product Depth (mm): 4.3mm; Wire Form: NotRequired; Lead Spacing (nom): NotRequiredmm; Case Style: Molded; Product Length (mm): 7.3mm; Voltage: 6.3VDC; DCL: 20.8uA; ESR: 0.05ohm; Product Height (mm): 2.9mm; Polarity: Polar; Datasheet URL: http://datasheets.avx.com/TPS.pdf; Mounting Style: SurfaceMount; Length W/Weld (max): NotRequiredmm; Construction: SMTChip; Package / Case: 7343-31; Product Diameter (mm): NotRequiredmm; Mounting Technology: SurfaceMount; Insulation: NotRequired; Operating Temp Range: -55Cto125C; Tolerance (+ or -): 10%; Failure Rate: NotRequired; Package URL: http://www.avx.com/download/software/literature/AVX-Footprint-Library.pdf; Packaging: TapeandReel; Case Code: D; Length W/Weld: NotRequiredmm; Manufacturer URL: http://www.avx.com/; Datasheet Version: 01/2017; Package Reference: CAPMP7344X31-T; Seated Plane Height: NotRequiredmm; Seal: NotRequired; Package Description: 2-Pin Surface Mount Device, Body 7.3 x 4.35 mm
D3 = LED GREEN: Light Emitting Diode; Reviewed by: RM - 2018/08/05; Revision: July-2002: Re-released for DXP Platform.; Supplier 1: Digi-Key; Supplier Part Number 1: 160-1423-1-ND
D4 = LED RED: Light Emitting Diode; Reviewed by: RM - 2018/08/05; Revision: July-2002: Re-released for DXP Platform.; Supplier 1: Digi-Key; Supplier Part Number 1: 475-1415-1-ND
J3 = USBPLUG: USB B Type Connector; Reviewed by: RM - 2018/08/05; Supplier 1: Digi-Key; Supplier Part Number 1: 609-1039-ND
L1 = I: Inductor; Reviewed by: RM - 2018/08/05; Value: 300mA; Supplier 1: *; Supplier Part Number 1: *
R30 R31 = R: Resistor; Reviewed by: RM - 2018/08/05; Value: 2K2; Supplier 1: *; Suppler Part Number 1: *
U13 = FT232RL: USB to Serial bridge; Reviewed by: RM - 2018/08/05; Supplier 1: Digi-Key; Supplier Part Number 1: 768-1007-1-ND
U14 = Si8421: Dual Channel Digital Isolator Both Ways; Reviewed by: RM - 2018/08/05; Supplier 1: Digi-Key; Supplier Part Number 1: 336-1755-5-ND

## Sheet DSO_Power.SchDoc: Schematic_Name
size A4; CompanyName: University of Melbourne; Engineer: Your Name Here; DocumentNumber: 1; Revision: 0.1; SheetNumber: 1; SheetTotal: 1; Title_Project: Project_Title; StudentNo: Student No.
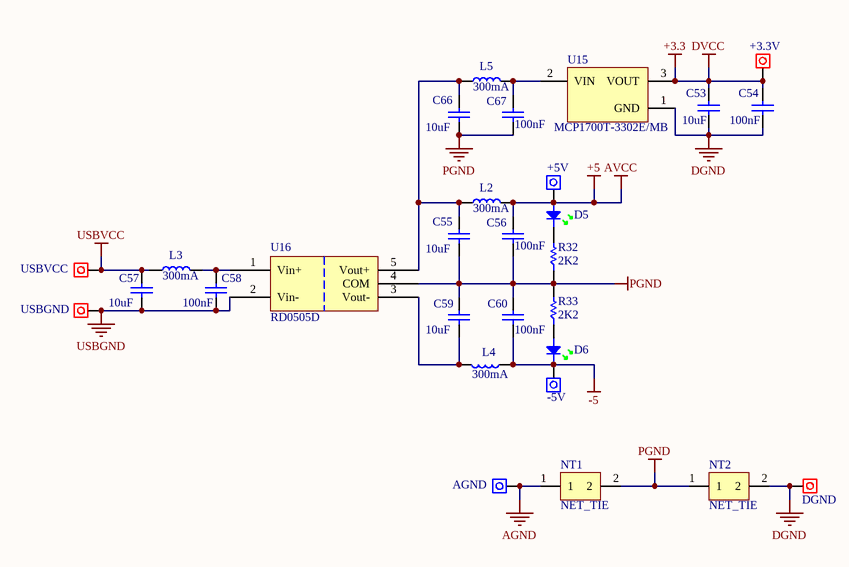
[diagram p9: DSO_Power.SchDoc]

### Parts
C53  10uF  [0805C]
C54  100nF  [0805C]
C55  10uF  [0805C]
C56  100nF  [0805C]
C57  10uF  [0805C]
C58  100nF  [0805C]
C59  10uF  [0805C]
C60  100nF  [0805C]
C66  10uF  [0805C]
C67  100nF  [0805C]
D5  +5V  [0805D-GREEN]  (value not drawn)
D6  -5V  [0805D-GREEN]  (value not drawn)
L2  300mA  [0805]
L3  300mA  [0805]
L4  300mA  [0805]
L5  300mA  [0805]
NT1  NET_TIE  [NET_TIE]  (net tie, no BOM)
NT2  NET_TIE  [NET_TIE]  (net tie, no BOM)
R32  2K2  [0805]
R33  2K2  [0805]
TP4  +3.3V  [Testpoin]  (no BOM)
TP5  DGND  [Testpoin]  (no BOM)
TP6  +5V  [PIN 1.8mm]  (no BOM)
TP8  USBVCC  [Testpoin]  (no BOM)
TP9  USBGND  [Testpoin]  (no BOM)
TP10  -5V  [PIN 1.8mm]  (no BOM)
TP11  AGND  [PIN 1.8mm]  (no BOM)
U15  MCP1700T-3302E/MB  [SOT89]
U16  RD0505D  [SIP_NMG]

### Nets
+3.3: C53.1 C54.1 TP4.1 U15.3(VOUT)  [also labelled DVCC]
+5: C56.1 D5.A L2.2 TP6.1  [also labelled AVCC]
-5: C60.1 D6.K L4.1 TP10.1
AGND: NT1.1 TP11.1
DGND: C53.2 C54.2 NT2.2 TP5.1 U15.1(GND)
PGND: C55.2 C56.2 C59.2 C60.2 C66.2 C67.2 NT1.2 NT2.1 R32.1 R33.2 U16.4(COM)
USBGND: C57.2 C58.2 TP9.1 U16.2(Vin-)
USBVCC: C57.1 L3.1 TP8.1
NetC55_1: C55.1 C66.1 L2.1 L5.1 U16.5(Vout+)
NetC58_1: C58.1 L3.2 U16.1(Vin+)
NetC59_1: C59.1 L4.2 U16.3(Vout-)
NetC67_1: C67.1 L5.2 U15.2(VIN)
NetD5_K: D5.K R32.2
NetD6_A: D6.A R33.1

### Library data of the parts
C53-C60 C66 C67 = C: Capacitor; Reviewed by: RM - 2018/08/05; Revision: July-2002: Re-released for DXP Platform.; Supplier 1: *; Supplier Part Number 1: *
  C53 C55 C57 C59 C66: Value: 10uF
  C54 C56 C58 C60 C67: Value: 100nF
D5 D6 = LED GREEN: as D3 on sheet DSO_IO; Revision: July-2002: Re-released for DXP Platform.; Supplier 1: Digi-Key; Supplier Part Number 1: 160-1423-1-ND
L2-L5 = I: Inductor; Reviewed by: RM - 2018/08/05; Supplier 1: *; Supplier Part Number 1: *; Value: 300mA
NT1 NT2 = NET_TIE: Net Tie
R32 R33 = R: Resistor; Reviewed by: RM - 2018/08/05; Supplier 1: *; Suppler Part Number 1: *; Value: 2K2
TP4 TP5 TP8 TP9 = Test Point: Pad
  TP4: Value: +3.3V
  TP5: Value: DGND
  TP8: Value: USBVCC
  TP9: Value: USBGND
TP6 TP10 TP11 = WIRE: Pad
U15 = MCP1700T: Low Quiescent Current LDO, 3-Pin SOT-89, Extended Temperature, Tape and Reel; Reviewed by: RM - 2018/08/05; Supplier 1: Digi-Key; Supplier Part Number 1: MCP1700T3302EMBCT-ND
U16 = RD0505D: (ADV) DC to DC converter 5V in +-5V out; Reviewed by: RM - 2018/08/05; Supplier Part Number 1: 945-1136-ND; Supplier 1: Digi-Key

## Nets that join several sheets
+3.3: DSO_ADC (5 pins), DSO_Trig (6 pins), DSO_Counters (U?#1.16 U?#2.16), DSO_CPLD (7 pins), DSO_RAM (5 pins), DSO_Clock (C64.1 U11.2 U11.7), DSO_Control (13 pins), DSO_IO (C52.1 U14.8), DSO_Power (C53.1 C54.1 TP4.1 U15.3)
+5: DSO_Front (C1.1 C2.1 D1.K U1.8), DSO_ADC (10 pins), DSO_Trig (10 pins), DSO_Power (C56.1 D5.A L2.2 TP6.1)
-5: DSO_Front (C3.1 C4.1 D2.A U1.4), DSO_ADC (6 pins), DSO_Power (C60.1 D6.K L4.1 TP10.1)
AGND: DSO_Front (10 pins), DSO_ADC (24 pins), DSO_Power (NT1.1 TP11.1)
DGND: DSO_ADC (6 pins), DSO_Trig (7 pins), DSO_Counters (U?#1.8 U?#1.14 U?#2.14), DSO_CPLD (27 pins), DSO_RAM (5 pins), DSO_Clock (C64.2 U11.3), DSO_Control (13 pins), DSO_IO (C52.2 U14.5), DSO_Power (5 pins)
GND: DSO_Counters (C?#1.2 C?#2.2 U?#2.8), DSO_Control (P?.6)
USBGND: DSO_IO (16 pins), DSO_Power (C57.2 C58.2 TP9.1 U16.2)
USBVCC: DSO_IO (13 pins), DSO_Power (C57.1 L3.1 TP8.1)
CLEAR_COUNT: DSO_Counters (U?#1.10 U?#2.10), DSO_CPLD (U17.31)
COUNTER_CLK: DSO_Counters (U?#1.11 U?#1.13 U?#2.13), DSO_CPLD (U17.29)
ENABLE_COUNT: DSO_Counters (U?#1.12 U?#2.12), DSO_CPLD (U17.30)
FULL: DSO_Counters (U?#2.9), DSO_CPLD (U17.7)